# Altium project nixie_clock_cpu.PrjPcb
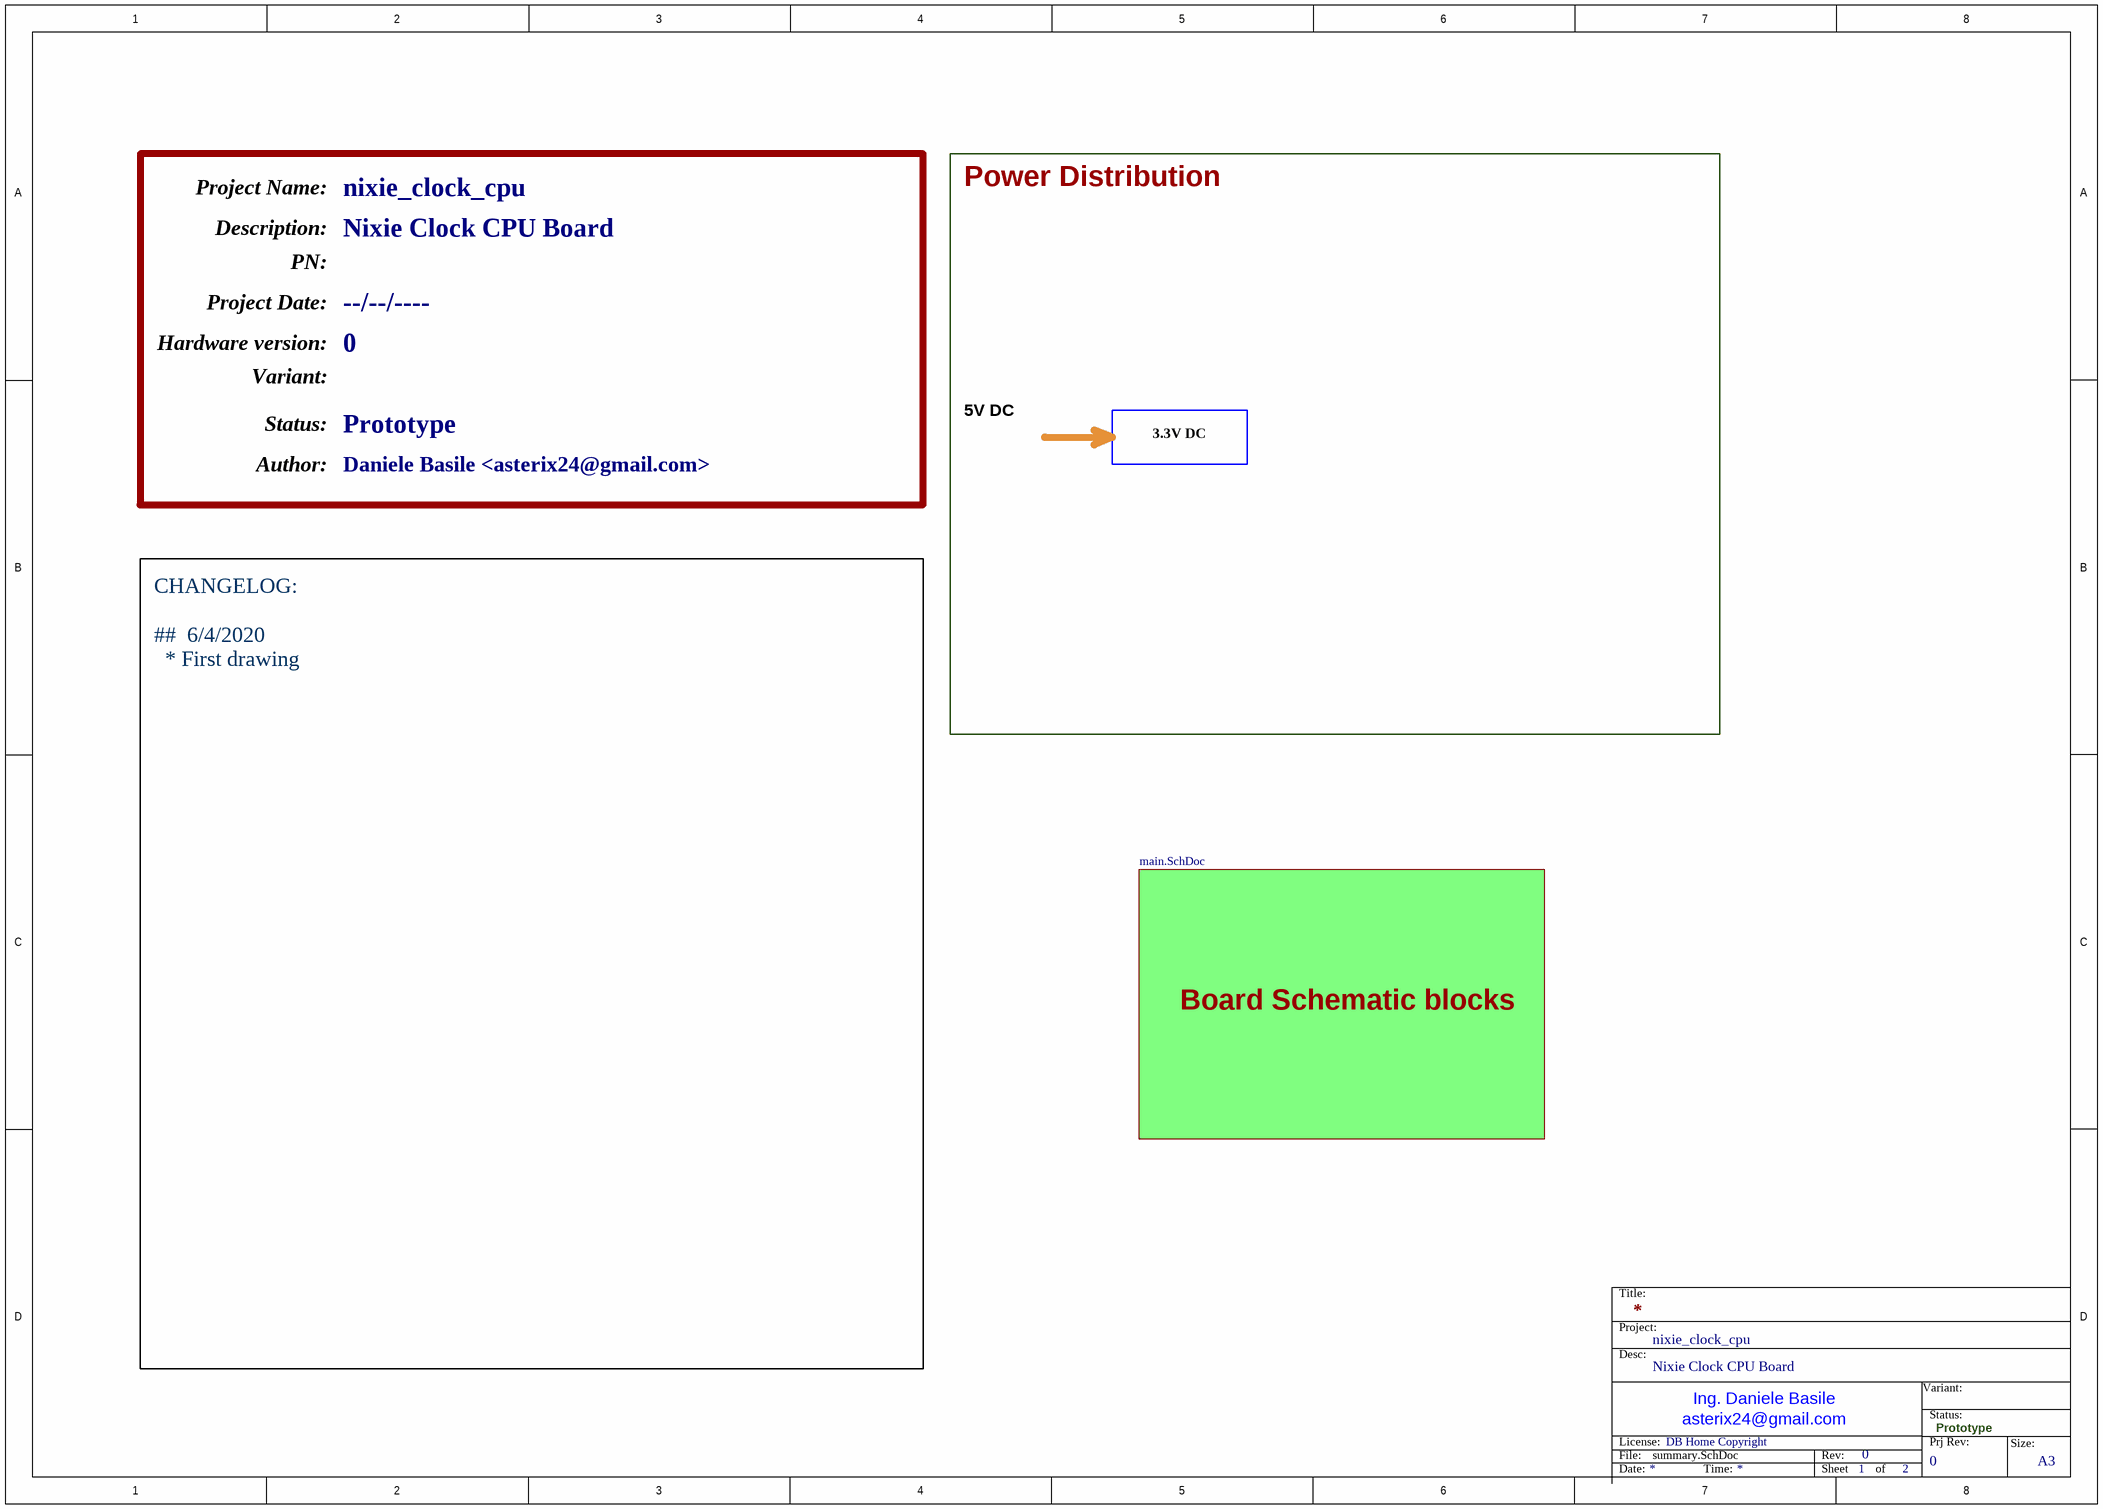
[diagram p0: summary.SchDoc]
pcb_2_dec_tol: +/-.01; pcb_3_dec_tol: +/-.010; pcb_address1: Via San Quirico 233/3; pcb_address2: 50013 Campi Bisenzio; pcb_address3: Firenze; pcb_address4: ITALIA; pcb_ang_tol: +/-1/2; pcb_checker: - -----; pcb_checker_app_date: --/--/----; pcb_designer: - -----; pcb_designer_app_date: --/--/----; pcb_dwg_no: <PCB DWG NO>; pcb_engineer: - -----; pcb_engineer_app_date: --/--/----; pcb_finish: HASL; pcb_layer_count: 2; pcb_material: FR4-Standard Tg 130-140C; pcb_organization: DB Home; pcb_scale: 1:1; pcb_stackup: Default; pcb_title1: <TITLE 1>; pcb_title2: <TITLE 2>; prj_date: --/--/----; prj_hw_ver: 0; prj_license: DB Home Copyright; prj_name: nixie_clock_cpu; prj_name_long: Nixie Clock CPU Board; prj_panel_name: nixie_clock_cpu_panel; prj_part_number: <PCB PN>; prj_pcb: A; prj_status: Prototype
2 sheets, 96 parts. Net scope: hierarchical (ports join the sheet entries above them; power ports are global).
Board file: nixi_ clock_cpu.PcbDoc
Sheets:
  summary.SchDoc
     = main.SchDoc

## Sheet summary.SchDoc
size A3; Hw_rev: R1; Author: Daniele Basile <asterix24@gmail.com>; Address3: Firenze; Address4: ITALY; Revision: 0; SheetNumber: 1; SheetTotal: 2

### Sub-sheets
? = main.SchDoc: no entries

### Notes on the sheet
- Project Name:
- Description:
- Power Distribution
- Project Date:
- PN:
- Hardware version:
- Variant:
- Status:
- 5V DC
- Author:
- 3.3V DC
- Board Schematic blocks
- CHANGELOG:
  ##  6/4/2020
  * First drawing
- Title:
- Project:
- Desc:
- File:
- License:
- asterix24@gmail.com
- Ing. Daniele Basile
- Rev:
- Prj Rev:
- Size:
- Date:
- Time:
- Sheet
- of
- A3

## Sheet main.SchDoc
size A3; Hw_rev: R1; Address3: Firenze; Address4: ITALY; Revision: 0; SheetNumber: 2; SheetTotal: 2
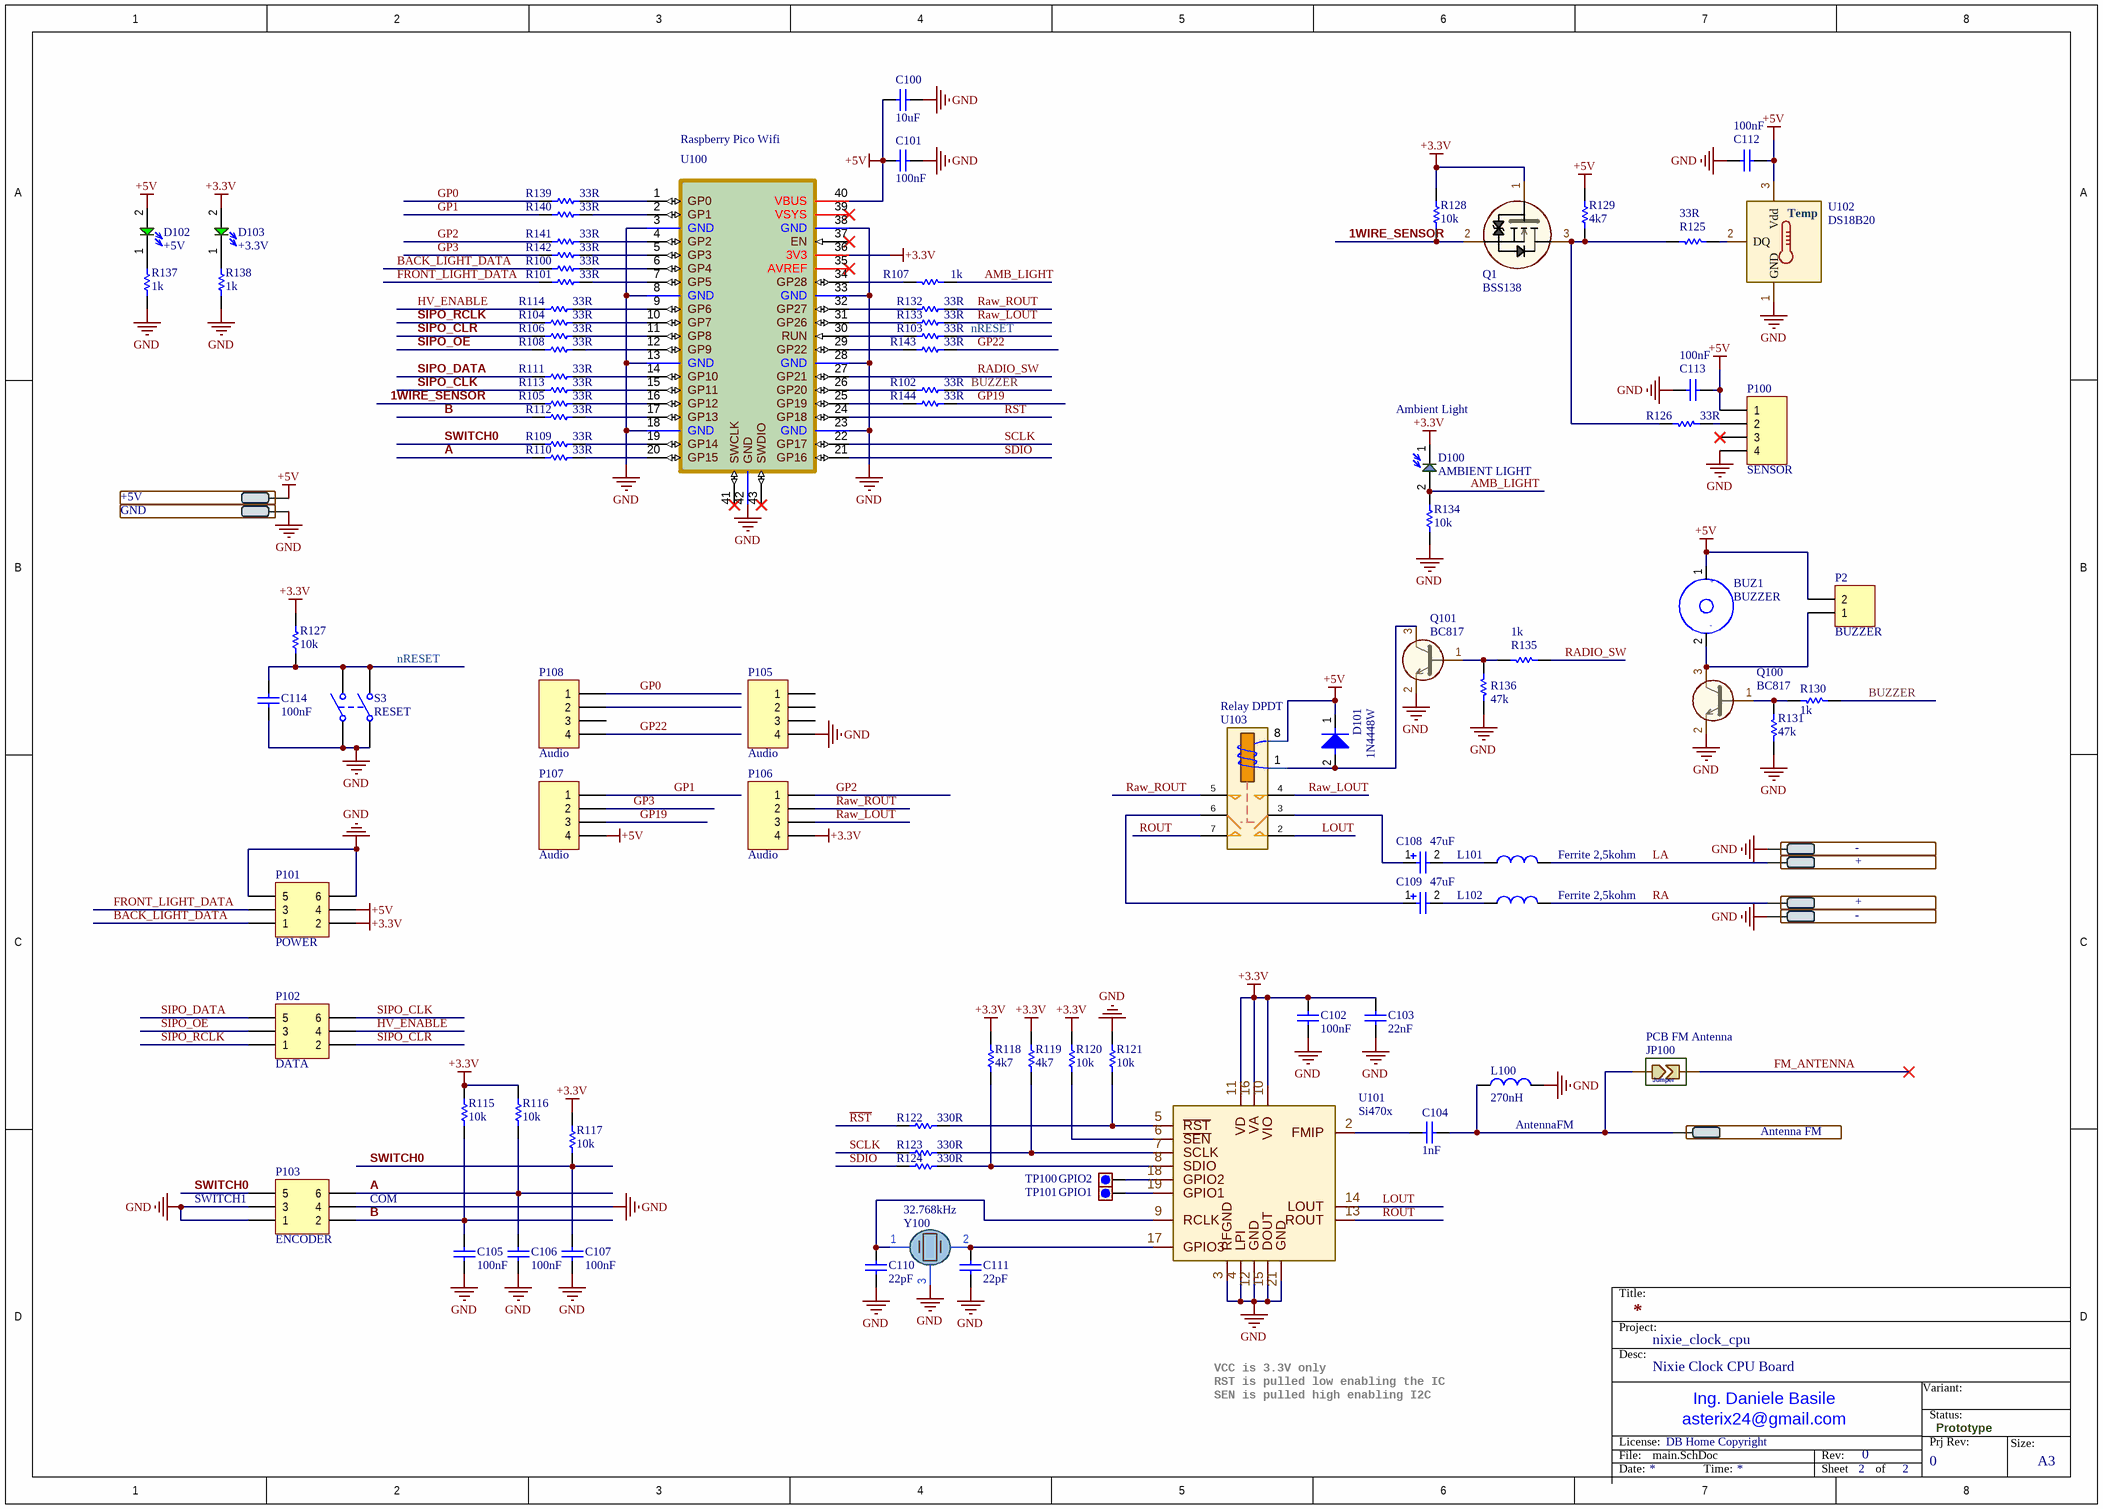
[diagram p1: main.SchDoc]

### Parts
BUZ1  BUZZER  [buzzer_14mm_thd]
C100  10uF  [0603_[1608]]
C101  100nF  [0603_[1608]]
C102  100nF  [0603_[1608]]
C103  22nF  [0603_[1608]]
C104  1nF  [0603_[1608]]
C105  100nF  [0603_[1608]]
C106  100nF  [0603_[1608]]
C107  100nF  [0603_[1608]]
C108  47uF  [[7343]_CAP_TAN_1P_2N]
C109  47uF  [[7343]_CAP_TAN_1P_2N]
C110  22pF  [0603_[1608]]
C111  22pF  [0603_[1608]]
C112  100nF  [0603_[1608]]
C113  100nF  [0603_[1608]]
C114  100nF  [0603_[1608]]
D100  AMBIENT LIGHT  [R5_LED_THD_A2-K1]
D101  1N4448W  [SOD-123_K1-A2]
D102  +5V  [0603_[1608]_K1-A2_LED]
D103  +3.3V  [0603_[1608]_K1-A2_LED]
J100  Antenna FM  [SMD_PIN_2x5MM]  (no BOM)
J101  -  [SMD_PIN_2x5MM]  (no BOM)
J102  +  [SMD_PIN_2x5MM]  (no BOM)
J103  +  [SMD_PIN_2x5MM]  (no BOM)
J104  -  [SMD_PIN_2x5MM]  (no BOM)
J105  +5V  [SMD_PIN_2x5MM]  (no BOM)
J106  GND  [SMD_PIN_2x5MM]  (no BOM)
JP100  PCB FM Antenna  [0603_[1608]_JUMPER]
L100  270nH  [0603_[1608]]
L101  Ferrite 2,5kohm  [0603_[1608]]
L102  Ferrite 2,5kohm  [0603_[1608]]
P2  BUZZER  [HEADER_1X2_2.54MM_THD]
P100  SENSOR  [HEADER_1X4_2.54MM_THD]
P101  POWER  [SOCKET_2x3_2.54mm_THD]
P102  DATA  [SOCKET_2x3_2.54mm_THD]
P103  ENCODER  [SOCKET_2x3_2.54mm_THD]
P105  Audio  [HEADER_1X4_2.54MM_THD]
P106  Audio  [HEADER_1X4_2.54MM_THD]
P107  Audio  [HEADER_1X4_2.54MM_THD]
P108  Audio  [HEADER_1X4_2.54MM_THD]
Q1  BSS138  [SOT-23]
Q100  BC817  [SOT-23]
Q101  BC817  [SOT-23]
R100  33R  [0603_[1608]]
R101  33R  [0603_[1608]]
R102  33R  [0603_[1608]]
R103  33R  [0603_[1608]]
R104  33R  [0603_[1608]]
R105  33R  [0603_[1608]]
R106  33R  [0603_[1608]]
R107  1k  [0603_[1608]]
R108  33R  [0603_[1608]]
R109  33R  [0603_[1608]]
R110  33R  [0603_[1608]]
R111  33R  [0603_[1608]]
R112  33R  [0603_[1608]]
R113  33R  [0603_[1608]]
R114  33R  [0603_[1608]]
R115  10k  [0603_[1608]]
R116  10k  [0603_[1608]]
R117  10k  [0603_[1608]]
R118  4k7  [0603_[1608]]
R119  4k7  [0603_[1608]]
R120  10k  [0603_[1608]]
R121  10k  [0603_[1608]]
R122  330R  [0603_[1608]]
R123  330R  [0603_[1608]]
R124  330R  [0603_[1608]]
R125  33R  [0603_[1608]]
R126  33R  [0603_[1608]]
R127  10k  [0603_[1608]]
R128  10k  [0603_[1608]]
R129  4k7  [0603_[1608]]
R130  1k  [0603_[1608]]
R131  47k  [0603_[1608]]
R132  33R  [0603_[1608]]
R133  33R  [0603_[1608]]
R134  10k  [0603_[1608]]
R135  1k  [0603_[1608]]
R136  47k  [0603_[1608]]
R137  1k  [0603_[1608]]
R138  1k  [0603_[1608]]
R139  33R  [0603_[1608]]
R140  33R  [0603_[1608]]
R141  33R  [0603_[1608]]
R142  33R  [0603_[1608]]
R143  33R  [0603_[1608]]
R144  33R  [0603_[1608]]
S3  RESET  [TACTILE_SWITCH_6x6MM_THD]
TP100  GPIO2  [TEST_POINT_THD_D1.6MM]  (no BOM)
TP101  GPIO1  [TEST_POINT_THD_D1.6MM]  (no BOM)
U100  Raspberry Pico Wifi  [RasberryPicoMod]
U101  Si470x  [QFN-50P-20_PAD]
U102  DS18B20  [TO-92]
U103  Relay DPDT  [RELAYS_DPST_THD_6x10_5.08mm]
Y100  32.768kHz  [CRISTAL_R26_PAD]

### Nets
+3.3V: C102.2 C103.2 D100.1(K) D103.2(A) P101.2 P106.4 Q1.1(G) R115.1 R116.1 R117.1 R118.1 R119.1 R120.1 R127.1 R128.1 U100.36(3V3) U101.10(VIO) U101.11(VD) U101.16(VA)
+5V: BUZ1.1 C100.1 C101.1 C112.1 C113.1 D101.1(K) D102.2(A) J105.1 P2.2 P100.1 P101.4 P107.4 R129.1 U100.40(VBUS) U102.3(Vdd) U103.8
GND: C100.2 C101.2 C102.1 C103.1 C105.1 C106.1 C107.1 C110.1 C111.1 C112.2 C113.2 C114.1 J101.1 J104.1 J106.1 L100.2 P100.4 P101.5 P101.6 P103.1 P103.3 P103.4 P105.4 Q100.2 Q101.2 R121.1 R131.1 R134.2 R136.1 R137.1 R138.1 S3.1(COMMON1) S3.2(COMMON2) U100.3(GND) U100.8(GND) U100.13(GND) U100.18(GND) U100.23(GND) U100.28(GND) U100.33(GND) U100.38(GND) U100.42(GND) U101.3(RFGND) U101.4(LPI) U101.12(GND) U101.15(DOUT) U101.21(GND) U102.1(GND) Y100.3
1WIRE_SENSOR: Q1.2(S) R105.2 R128.2
A: C106.2 P103.6 R110.2 R116.2
AMB_LIGHT: D100.2(A) R107.1 R134.1
B: C105.2 P103.2 R112.2 R115.2
BACK_LIGHT_DATA: P101.1 R100.2
BUZZER: R102.1 R130.1
FM_ANTENNA: JP100.2
FRONT_LIGHT_DATA: P101.3 R101.2
GP0: P108.1 R139.2
GP1: P107.1 R140.2
GP2: P106.1 R141.2
GP3: P107.2 R142.2
GP19: P107.3 R144.1
GP22: P108.4 R143.1
HV_ENABLE: P102.4 R114.2
LA: J102.1 L101.2
LOUT: U101.14(LOUT) U103.2
nRESET: C114.2 R103.1 R127.2 S3.3(NO1) S3.4(NO2)
~{RST}: R122.2 U100.24(GP18)
RA: J103.1 L102.2
RADIO_SW: R135.1 U100.27(GP21)
Raw_LOUT: P106.3 R133.1 U103.4
Raw_ROUT: P106.2 R132.1 U103.5
ROUT: U101.13(ROUT) U103.7
SCLK: R123.2 U100.22(GP17)
SDIO: R124.2 U100.21(GP16)
SIPO_CLK: P102.6 R113.2
SIPO_CLR: P102.2 R106.2
SIPO_DATA: P102.5 R111.2
SIPO_OE: P102.3 R108.2
SIPO_RCLK: P102.1 R104.2
SWITCH0: C107.2 P103.5 R109.2 R117.2
NetBUZ1_2: BUZ1.2 P2.1 Q100.3
NetC104_1: C104.1 U101.2(FMIP)
NetC104_2: C104.2 J100.1 JP100.1 L100.1
NetC108_1: C108.1 U103.3
NetC108_2: C108.2 L101.1
NetC109_1: C109.1 U103.6
NetC109_2: C109.2 L102.1
NetC110_2: C110.2 U101.9(RCLK) Y100.1
NetC111_2: C111.2 U101.17(GPIO3) Y100.2
NetD101_2: D101.2(A) Q101.3 U103.1(T1)
NetD102_1: D102.1(K) R137.2
NetD103_1: D103.1(K) R138.2
NetP100_2: P100.2 R126.1
NetQ1_3: Q1.3(D) R125.2 R126.2 R129.2
NetQ100_1: Q100.1 R130.2 R131.2
NetQ101_1: Q101.1 R135.2 R136.2
NetR100_1: R100.1 U100.6(GP4)
NetR101_1: R101.1 U100.7(GP5)
NetR102_2: R102.2 U100.26(GP20)
NetR103_2: R103.2 U100.30(RUN)
NetR104_1: R104.1 U100.10(GP7)
NetR105_1: R105.1 U100.16(GP12)
NetR106_1: R106.1 U100.11(GP8)
NetR107_2: R107.2 U100.34(GP28)
NetR108_1: R108.1 U100.12(GP9)
NetR109_1: R109.1 U100.19(GP14)
NetR110_1: R110.1 U100.20(GP15)
NetR111_1: R111.1 U100.14(GP10)
NetR112_1: R112.1 U100.17(GP13)
NetR113_1: R113.1 U100.15(GP11)
NetR114_1: R114.1 U100.9(GP6)
NetR118_2: R118.2 R124.1 U101.8(SDIO)
NetR119_2: R119.2 R123.1 U101.7(SCLK)
NetR120_2: R120.2 U101.6(~{SEN})
NetR121_2: R121.2 R122.1 U101.5(~{RST})
NetR125_1: R125.1 U102.2(DQ)
NetR132_2: R132.2 U100.32(GP27)
NetR133_2: R133.2 U100.31(GP26)
NetR139_1: R139.1 U100.1(GP0)
NetR140_1: R140.1 U100.2(GP1)
NetR141_1: R141.1 U100.4(GP2)
NetR142_1: R142.1 U100.5(GP3)
NetR143_2: R143.2 U100.29(GP22)
NetR144_2: R144.2 U100.25(GP19)
NetTP100_1: TP100.1 U101.18(GPIO2)
NetTP101_1: TP101.1 U101.19(GPIO1)

Not connected (* = marked no-connect by the designer): P100 3*; P105 1 2 3; P108 2 3; U100 35(AVREF)* 37(EN)* 39(VSYS)* 41(SWCLK)* 43(SWDIO)*

### Notes on the sheet
- (near D100) Ambient Light
- (near L100) AntennaFM
- (near P103) SWITCH1
- (near P103) COM
- SEN is pulled high enabling I2C
- RST is pulled low enabling the IC
- VCC is 3.3V only
- Title:
- Project:
- Desc:
- Variant:
- File:
- License:
- asterix24@gmail.com
- Ing. Daniele Basile
- Rev:
- Prj Rev:
- Status:
- Size:
- Date:
- Time:
- Sheet
- of
- A3
- (in symbol BUZZER) +; -
- (in symbol DS18B20) Temp
- (in symbol JumperSMD) Jumper

### Library data of the parts
C100-C107 C110-C114 = Cap: Capacitor; NOTE Manufacturer PN: *; NOTE Manufacturer: *; MountTechnology: *; CODE Develer: *; ComponentLink1Description: New link; ComponentLink1URL: *; NOTE Description: *; NOTE Description 2: *
  C100: Value: 10uF
  C101 C102 C105-C107 C112-C114: Value: 100nF
  C103: Value: 22nF
  C104: Value: 1nF
  C110 C111: Value: 22pF
C108 C109 = CapPol: Capacitor; Value: 47uF; NOTE Manufacturer PN: *; NOTE Manufacturer: *; MountTechnology: *; CODE Develer: *; ComponentLink1Description: New link; ComponentLink1URL: *; NOTE Description: *; NOTE Description 2: *
D100 = PhotoDiode: Diode Led; Publisher: Develer srl; Revision: 0.1; NOTE Manufacturer PN: *; NOTE Manufacturer: *; MountTechnology: SMT; CODE Develer: *; NOTE Description: *; NOTE Description 2: *
D101 = Diode: Diode, Rectifier, 0,5A, 30V min (MBR230LSFT1G; Rohm RB070MM-30TR; panjin SBA130ASR100001); CODE Develer: D-S-0001; MountTechnology: SMT
D102 D103 = DiodeLedSmall_GREEN: Diode Led; Publisher: Develer srl; Revision: 0.1; NOTE Manufacturer PN: *; NOTE Manufacturer: *; MountTechnology: SMT; CODE Develer: *; NOTE Description: *; NOTE Description 2: *
J100-J106 = SolderPad: Solder pad; Publisher: Develer srl; Revision: 0.1; NOTE Manufacturer PN: *; NOTE Manufacturer: *; MountTechnology: SMT; CODE Develer: *; NOTE Description: *; NOTE Description 2: *
JP100 = JumperSMD: Jumper SMD; Publisher: Develer srl; Revision: 0.1; NOTE Manufacturer PN: *; NOTE Manufacturer: *; MountTechnology: SMT; CODE Develer: *; NOTE Description: *; NOTE Description 2: *
L100 = Inductor: ComponetDescritions (altrenative1; alternativ2); Publisher: Develer srl; Revision: 0.1; NOTE Manufacturer PN: *; NOTE Manufacturer: *; MountTechnology: SMT; CODE Develer: *; NOTE Description: *; NOTE Description 2: *
L101 L102 = Inductor: BLM18BD252SN1D; Publisher: Develer srl; Revision: 0.1; NOTE Manufacturer PN: *; NOTE Manufacturer: *; MountTechnology: SMT; CODE Develer: *; NOTE Description: *; NOTE Description 2: *
P2 = Header 2: Pin Header, 2pin, 2.54mm; LatestRevisionDate: 17-Jul-2002; LatestRevisionNote: Re-released for DXP Platform.; Publisher: Altium Limited
P100 P105-P108 = Header 4: Header, 4-Pin; LatestRevisionDate: 17-Jul-2002; LatestRevisionNote: Re-released for DXP Platform.; Publisher: Altium Limited
P101-P103 = Header 3X2: Header, 3-Pin, Dual row; LatestRevisionDate: 17-Jul-2002; LatestRevisionNote: Re-released for DXP Platform.; Publisher: Altium Limited
Q1 = BSS138: N-MOSFET 50V 0,22A; Publisher: Develer srl; Revision: 0.1; NOTE Manufacturer PN: *; NOTE Manufacturer: *; MountTechnology: SMT; CODE Develer: *; NOTE Description: *; NOTE Description 2: *
Q100 Q101 = NPN_3P: Transistor BJT NPN; Publisher: Develer srl; Revision: 0.1; NOTE Manufacturer PN: *; NOTE Manufacturer: *; MountTechnology: SMT; CODE Develer: *; NOTE Description: *; NOTE Description 2: *
R100-R144 = Res: Resistor; Publisher: Develer srl; Revision: 0.1; NOTE Manufacturer PN: *; NOTE Manufacturer: *; MountTechnology: SMT; CODE Develer: *; NOTE Description: *; NOTE Description 2: *
S3 = Switch DPST: Double-Pole, Single-Throw Switch; Published: 24-Mar-1999; LatestRevisionDate: 17-Jul-2002; LatestRevisionNote: Re-released for DXP Platform.; PackageReference: DPST-4; Publisher: Altium Limited; PackageDescription: Switch; 4 Leads
TP100 TP101 = TestPoint: Publisher: Develer srl; Revision: 0.1; NOTE Manufacturer PN: *; NOTE Manufacturer: *; MountTechnology: SMT; CODE Develer: *; NOTE Description: *; NOTE Description 2: *
U100 = RaspberryPico_Mod: Raspberry PICO som module; Publisher: Develer srl; Revision: 0.1; NOTE Manufacturer PN: *; NOTE Manufacturer: *; MountTechnology: SMT; CODE Develer: *; NOTE Description: *; NOTE Description 2: *
U101 = Si470x: Full FM radio whit RDS; Publisher: Develer srl; Revision: 0.1; NOTE Manufacturer PN: *; NOTE Manufacturer: *; MountTechnology: SMT; CODE Develer: *; NOTE Description: *; NOTE Description 2: *
U102 = DS18B20: Programmable Resolution 1-Wire Digital Thermometer; Publisher: Develer srl; Revision: 0.1; NOTE Manufacturer PN: *; NOTE Manufacturer: *; MountTechnology: SMT; CODE Develer: *; NOTE Description: *; NOTE Description 2: *
U103 = Relay2_DPDT: Publisher: Develer srl; Revision: 0.1; NOTE Manufacturer PN: *; NOTE Manufacturer: *; MountTechnology: SMT; CODE Develer: *; NOTE Description: *; NOTE Description 2: *
Y100 = Cristal_3P: ComponentDescriptions (altrenative1; alternative2); Publisher: Develer srl; Revision: 0.1; NOTE Manufacturer PN: *; NOTE Manufacturer: *; MountTechnology: SMT; CODE Develer: *; NOTE Description: *; NOTE Description 2: *